# EAGLE design 5_to_var (EAGLE 6.1)
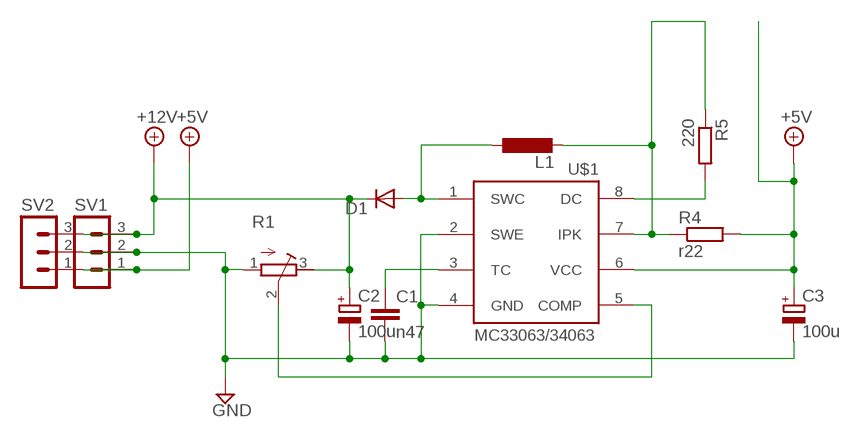
[diagram p0: schematic, sheet 1]

## Parts
C1  n47  C-EU025-025X050  [C025-025X050]
C2  100u  CPOL-EUE2.5-7  [E2,5-7]
C3  100u  CPOL-EUE2.5-7  [E2,5-7]
D1  DIODE-D-2.5  [D-2.5]
L1  L-EU0207/2V  [0207/2V]
R1  R-TRIMM3296X  [RTRIM3296X]
R4  r22  R-EU_0207/2V  [0207/2V]
R5  220  R-EU_0207/2V  [0207/2V]
SV1  MA03-1  [MA03-1]
SV2  MA03-1  [MA03-1]
U$1  MC33063/MC34063P  [DIL08]

## Nets
+5V: C3.+ R4.2 SV1.1 SV2.1 U$1.6(VCC)
+12V: C2.+ D1.C R1.3(E) SV1.3 SV2.3
GND: C1.2 C2.- C3.- R1.1(A) SV1.2 SV2.2 U$1.2(SWE) U$1.4(GND)
N$1: R5.2 U$1.8(DC)
N$2: L1.2 R4.1 R5.1 U$1.7(IPK)
N$7: C1.1 U$1.3(TC)
N$8: D1.A L1.1 U$1.1(SWC)
N$9: R1.2(S) U$1.5(COMP)

## Library data of the parts
C1 = rcl:C-EU: CAPACITOR, European symbol
C2 C3 = rcl:CPOL-EU: POLARIZED CAPACITOR, European symbol
D1 = diode:DIODE-: DIODE
L1 = rcl:L-EU: INDUCTOR, European symbol
R1 = rcl:R-TRIMM: Trimm resistor
R4 R5 = rcl:R-EU_: RESISTOR, European symbol
SV1 SV2 = con-lstb:MA03-1: PIN HEADER; OC_FARNELL: unknown; OC_NEWARK: unknown
U$1 = adafruit_t10:MC33063/MC34063: MC33063 and MC34063 Basic DC/DC converter with internal power-NPN transistor, 100KHz, 1.5A peak switch current. 3-40 input/output.

## Board
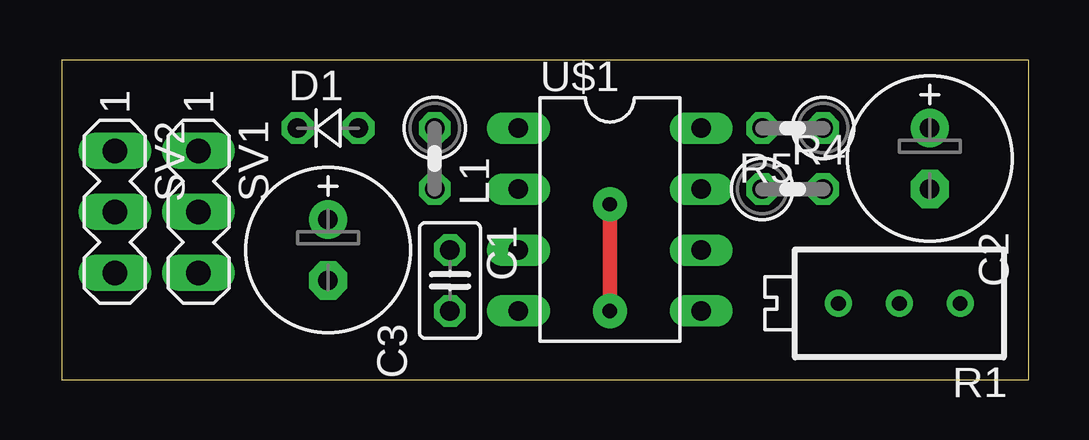
[diagram p1: board, top side]
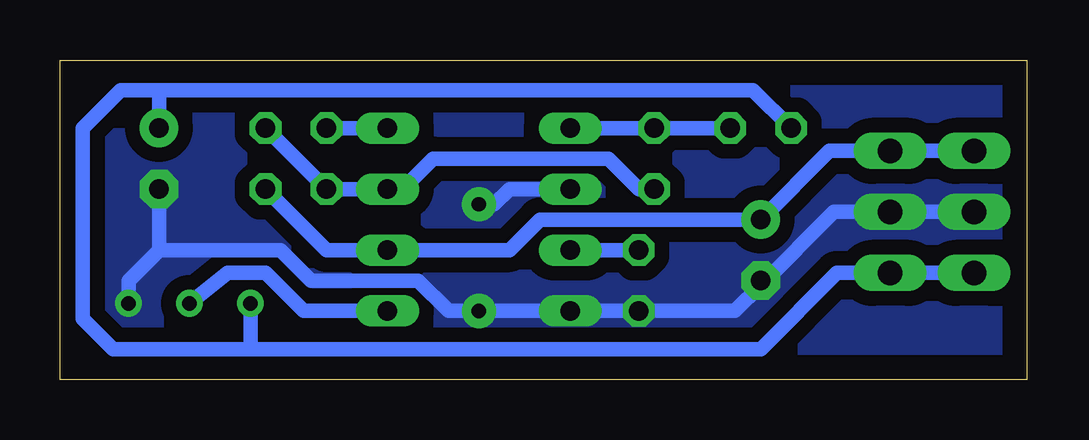
[diagram p2: board, bottom side, seen from below]

Size 40.31 x 13.31 mm. Coordinates in mm from the lower left corner, seen from the top.
Outline: 40.31,0 40.31,13.31 0,13.31 0,0 40.31,0
Copper layers (1*16): Top 0.035mm / dielectric 1.5mm / Bottom 0.035mm
Design rules: minimum track width 10mil, minimum drill 24mil, track to track 8mil, track to pad 8mil, pad to pad 8mil, via to via 8mil, smd to smd 8mil, copper to edge 40mil, drill to drill 8mil, minimum pad ring 10mil, minimum via ring 8mil, stop-mask expansion 4mil, vias tented up to drill 0mil, thermal gap 10mil

### Footprints (pad centres in the part's own frame; a part is rotated, then mirrored left to right if it is on the bottom)
C025-025X050 = drill 0.813 octagon: 1 -1.27,0; 2 1.27,0
E2,5-7 = drill 0.813 pad 1.6: + -1.27,0 | drill 0.813 pad 1.6 octagon: - 1.27,0
D-2.5 = drill 0.813 octagon: A 1.27,0; C -1.27,0
0207/2V = drill 0.813 octagon: 1 -1.27,0; 2 1.27,0
RTRIM3296X = drill 0.61: 1 0,-2.54; 2 0,0; 3 0,2.54
MA03-1 = drill 1.016 long: 1 -2.54,0; 2 0,0; 3 2.54,0
DIL08 = drill 0.813 long: 1 -3.81,-3.81; 2 -1.27,-3.81; 3 1.27,-3.81; 4 3.81,-3.81; 5 3.81,3.81; 6 1.27,3.81; 7 -1.27,3.81; 8 -3.81,3.81

### Placement (x,y rotation side)
C1  16.18,4.13 270 top
C2  36.18,9.21 270 top
C3  11.1,5.4 270 top
D1  11.1,10.48 0 top
L1  15.54,9.21 270 top
R1  34.91,3.17 90 top
R4  30.47,7.94 0 top
R5  30.47,10.48 180 top
SV1  5.7,6.99 270 top
SV2  2.21,6.99 270 top
U$1  22.85,6.67 270 top

### Tracks (layer width: path | path; a pad name or v marks a point on that pad's centre or on a via)
+5V
  Bottom 0.61: SV2.1 SV1.1 8.24,9.53 C3.+ 20.31,6.67 21.58,5.4 U$1.6 29.2,5.4 R4.2
+12V
  Bottom 0.61: 32.37,1.27 38.09,1.27 39.36,2.54 39.36,10.48 37.77,12.06 36.18,12.06 | 32.37,1.27 11.1,1.27 7.93,4.45 SV1.3 SV2.3 | 36.18,12.06 11.42,12.06 D1.C | R1.3 32.37,1.27 | C2.+ 36.18,12.06
GND  (via drill 0.6 pad 1.42)
  Top 0.61: v22.85,7.3 v22.85,2.86
  Bottom 0.61: SV2.2 SV1.2 8.05,6.99 11.1,3.94 | U$1.2 21.58,7.94 22.21,7.3 v22.85,7.3 | 11.1,3.94 12.18,2.86 C1.2 U$1.4 v22.85,2.86 24.12,2.86 25.39,4.13 29.83,4.13 31.1,5.4 36.18,5.4 | C3.- 11.1,3.94 | 36.18,5.4 C2.- | R1.1 37.45,4.13 36.18,5.4
  pour Bottom (isolate 0.61, no thermals): -0.65,-0.64 40.95,-0.64 40.95,13.65 40.95,13.97 -0.65,13.97
N$1
  Bottom 0.61: R5.2 U$1.8
N$2
  Bottom 0.61: L1.2 16.18,7.94 17.45,9.21 24.75,9.21 26.02,7.94 U$1.7 R4.1 R5.1
N$7
  Bottom 0.61: C1.1 U$1.3
N$8
  Bottom 0.61: U$1.1 L1.1 D1.A
N$9
  Bottom 0.61: U$1.5 30.15,2.86 31.74,4.45 33.32,4.45 R1.2